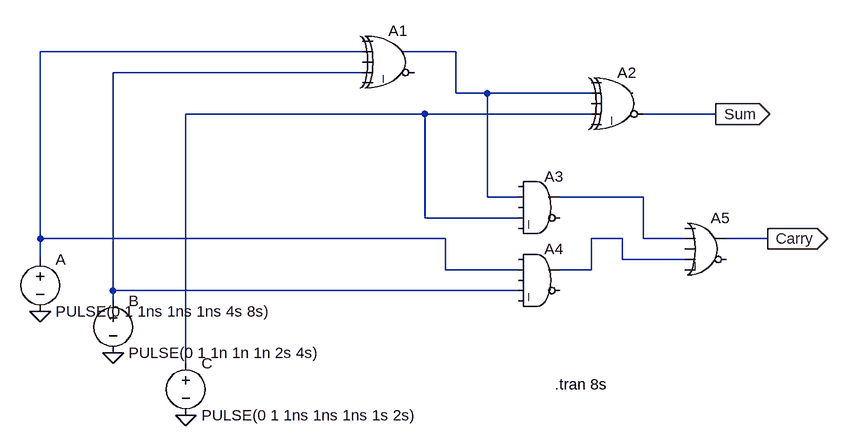
[diagram p0: schematic Full Adder.asc]
Full Adder.asc, the LTspice schematic file:
Version 4
SHEET 1 1080 680
WIRE 352 80 -144 80
WIRE 496 80 416 80
WIRE 352 112 -32 112
WIRE 496 144 496 80
WIRE 544 144 496 144
WIRE 704 144 544 144
WIRE 448 176 80 176
WIRE 704 176 448 176
WIRE 896 176 784 176
WIRE 544 304 544 144
WIRE 592 304 544 304
WIRE 784 304 656 304
WIRE 448 336 448 176
WIRE 592 336 448 336
WIRE -144 368 -144 80
WIRE 480 368 -144 368
WIRE 752 368 704 368
WIRE 784 368 784 304
WIRE 848 368 784 368
WIRE 976 368 912 368
WIRE -144 400 -144 368
WIRE 752 400 752 368
WIRE 848 400 752 400
WIRE 480 416 480 368
WIRE 592 416 480 416
WIRE 704 416 704 368
WIRE 704 416 656 416
WIRE -32 448 -32 112
WIRE 592 448 -32 448
WIRE -32 464 -32 448
WIRE 80 560 80 176
FLAG 896 176 Sum
IOPIN 896 176 Out
FLAG 976 368 Carry
IOPIN 976 368 Out
FLAG 80 640 0
FLAG -32 544 0
FLAG -144 480 0
SYMBOL voltage -144 384 R0
SYMATTR InstName A
SYMATTR Value PULSE(0 1 1ns 1ns 1ns 4s 8s)
SYMBOL voltage -32 448 R0
SYMATTR InstName B
SYMATTR Value PULSE(0 1 1n 1n 1n 2s 4s)
SYMBOL voltage 80 544 R0
SYMATTR InstName C
SYMATTR Value PULSE(0 1 1ns 1ns 1ns 1s 2s)
SYMBOL Digital/xor 400 32 R0
SYMATTR InstName A1
SYMBOL Digital/xor 752 96 R0
SYMATTR InstName A2
SYMBOL Digital/and 624 256 R0
SYMATTR InstName A3
SYMBOL Digital/and 624 368 R0
SYMATTR InstName A4
SYMBOL Digital/or 880 320 R0
SYMATTR InstName A5
TEXT 648 592 Left 2 !.tran 8s

The netlist it stands for:
* Full Adder.asc
V§A N001 0 PULSE(0 1 1ns 1ns 1ns 4s 8s)
V§B N003 0 PULSE(0 1 1n 1n 1n 2s 4s)
V§C N004 0 PULSE(0 1 1ns 1ns 1ns 1s 2s)
A1 0 N001 0 N003 0 0 N002 0 XOR
A2 0 N002 0 N004 0 Sum 0 0 XOR
A3 0 N002 0 N004 0 0 N005 0 AND
A4 0 N001 0 N003 0 0 N006 0 AND
A5 0 N005 0 N006 0 0 Carry 0 OR
.tran 8s
.backanno
.end